# Altium schematic sheet Receiver.SchDoc
size A3; Organization: Altium Limited; Address1: L3, 12a Rodborough Rd; Address2: Frenchs Forest; Address3: NSW; Address4: Australia 2086
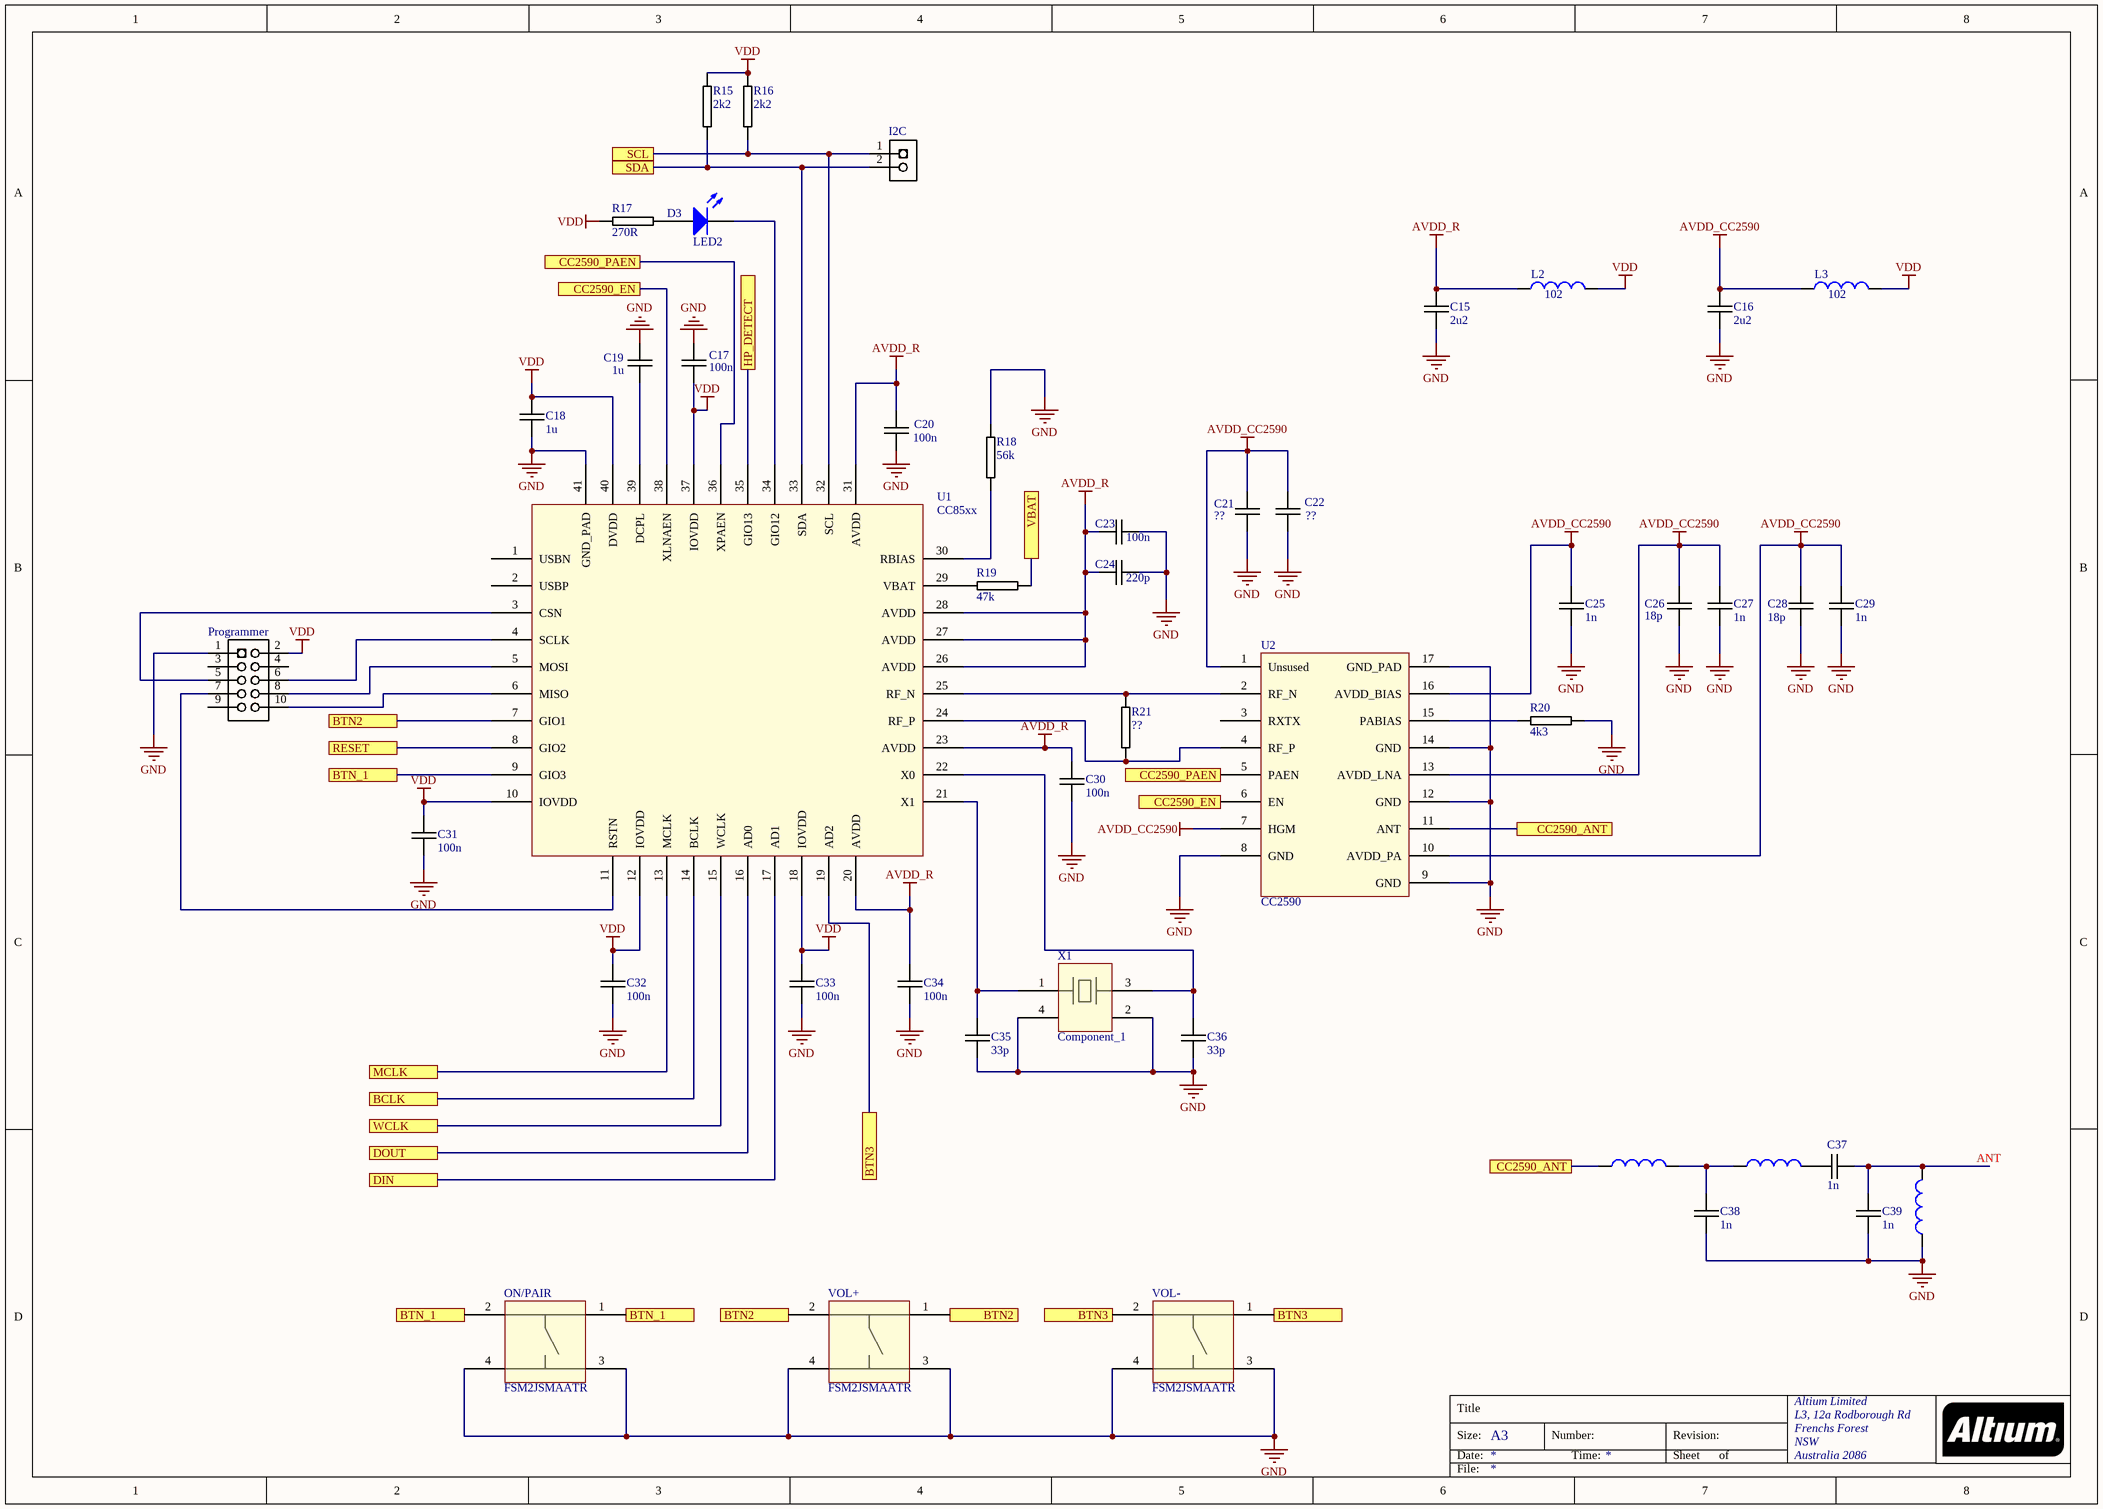
[diagram p0: Receiver.SchDoc]

## Parts
C15  2u2  [0402C-TBD]
C16  2u2  [0402C-TBD]
C17  100n  [0402C-TBD]
C18  1u  [0402C-TBD]
C19  1u  [0402C-TBD]
C20  100n  [0402C-TBD]
C21  ??  [0402C-TBD]
C22  ??  [0402C-TBD]
C23  100n  [0402C-TBD]
C24  220p  [0402C-TBD]
C25  1n  [0402C-TBD]
C26  18p  [0402C-TBD]
C27  1n  [0402C-TBD]
C28  18p  [0402C-TBD]
C29  1n  [0402C-TBD]
C30  100n  [0402C-TBD]
C31  100n  [0402C-TBD]
C32  100n  [0402C-TBD]
C33  100n  [0402C-TBD]
C34  100n  [0402C-TBD]
C35  33p  [0402C-TBD]
C36  33p  [0402C-TBD]
C37  1n  [0402C-TBD]
C38  1n  [0402C-TBD]
C39  1n  [0402C-TBD]
D3  LED2  [0402C-GENERIC]
I2C  I2C  [HEADER-1X2]  (value not drawn)
L2  value 102  [0402-A]  (hidden comment: Inductor)
L3  value 102  [0402-A]  (hidden comment: Inductor)
L11  Inductor  [0402-A]  (value not drawn)
L12  Inductor  [0402-A]  (value not drawn)
L13  Inductor  [0402-A]  (value not drawn)
ON/PAIR  FSM2JSMAATR  [Tactile Button]
Programmer  Programm  [HEADER-2X5]  (value not drawn)
R15  2k2  [0402R-GENERIC]
R16  2k2  [0402R-GENERIC]
R17  270R  [0402R-GENERIC]
R18  56k  [0402R-GENERIC]
R19  47k  [0402R-GENERIC]
R20  4k3  [0402R-GENERIC]
R21  ??  [0402R-GENERIC]
U1  CC85xx  [QFN40]
U2  CC2590  [QFN16]
VOL+  FSM2JSMAATR  [Tactile Button]
VOL-  FSM2JSMAATR  [Tactile Button]
X1  Component_1  [*XTALDFN200X160X70-4N]

## Ports
BCLK, BTN2, BTN3, BTN_1, CC2590_ANT, CC2590_EN, CC2590_PAEN, DIN, DOUT, HP_DETECT, MCLK, RESET, SCL, SDA, VBAT, WCLK

## Nets
AVDD_CC2590: C16.1 C21.1 C22.1 C25.1 C26.1 C27.1 C28.1 C29.1 L3.1 U2.1(Unsused) U2.7(HGM) U2.10(AVDD_PA) U2.13(AVDD_LNA) U2.16(AVDD_BIAS)
AVDD_R: C15.1 C20.1 C23.2 C24.2 C30.1 C34.1 L2.1 U1.20(AVDD) U1.23(AVDD) U1.26(AVDD) U1.27(AVDD) U1.28(AVDD) U1.31(AVDD)
GND: C15.2 C16.2 C17.1 C18.2 C19.1 C20.2 C21.2 C22.2 C23.1 C24.1 C25.2 C26.2 C27.2 C28.2 C29.2 C30.2 C31.2 C32.2 C33.2 C34.2 C35.2 C36.2 C38.2 C39.2 L13.1 ON/PAIR.3 ON/PAIR.4 Programmer.1 R18.1 R20.2 U1.41(GND_PAD) U2.8(GND) U2.9(GND) U2.12(GND) U2.14(GND) U2.17(GND_PAD) VOL+.3 VOL+.4 VOL-.3 VOL-.4 X1.2 X1.4
VDD: C17.2 C18.1 C31.1 C32.1 C33.1 L2.2 L3.2 Programmer.2 R15.1 R16.1 R17.1 U1.10(IOVDD) U1.12(IOVDD) U1.18(IOVDD) U1.37(IOVDD) U1.40(DVDD)
BCLK: U1.14(BCLK) ; port BCLK
BTN2: U1.7(GIO1) VOL+.1 VOL+.2 ; port BTN2
BTN3: U1.19(AD2) VOL-.1 VOL-.2 ; port BTN3
BTN_1: ON/PAIR.1 ON/PAIR.2 U1.9(GIO3) ; port BTN_1
CC2590_ANT: L11.1 U2.11(ANT) ; port CC2590_ANT
CC2590_EN: U1.38(XLNAEN) U2.6(EN) ; port CC2590_EN
CC2590_PAEN: U1.36(XPAEN) U2.5(PAEN) ; port CC2590_PAEN
DIN: U1.17(AD1) ; port DIN
DOUT: U1.16(AD0) ; port DOUT
HP_DETECT: U1.35(GIO13) ; port HP_DETECT
MCLK: U1.13(MCLK) ; port MCLK
RESET: U1.8(GIO2) ; port RESET
SCL: I2C.1 R16.2 U1.32(SCL) ; port SCL
SDA: I2C.2 R15.2 U1.33(SDA) ; port SDA
VBAT: R19.2 ; port VBAT
WCLK: U1.15(WCLK) ; port WCLK
NetC19_2: C19.2 U1.39(DCPL)
NetC35_1: C35.1 U1.21(X1) X1.1
NetC36_1: C36.1 U1.22(X0) X1.3
NetC37_1: C37.1 L12.2
NetC37_2: C37.2 C39.1 L13.2
NetC38_1: C38.1 L11.2 L12.1
NetD3_1: D3.1(A) R17.2
NetD3_2: D3.2(K) U1.34(GIO12)
NetProgrammer_5: Programmer.5 U1.3(CSN)
NetProgrammer_6: Programmer.6 U1.4(SCLK)
NetProgrammer_7: Programmer.7 U1.11(RSTN)
NetProgrammer_8: Programmer.8 U1.5(MOSI)
NetProgrammer_10: Programmer.10 U1.6(MISO)
NetR18_2: R18.2 U1.30(RBIAS)
NetR19_1: R19.1 U1.29(VBAT)
NetR20_1: R20.1 U2.15(PABIAS)
NetR21_1: R21.1 U1.24(RF_P) U2.4(RF_P)
NetR21_2: R21.2 U1.25(RF_N) U2.2(RF_N)

Not connected (* = marked no-connect by the designer): Programmer 3 4 9; U1 1(USBN) 2(USBP); U2 3(RXTX)

## Notes on the sheet
- ANT
- Title
- Size:
- Date:
- A3
- Number:
- Time:
- Revision:
- Sheet
- of
- File:

## Library data of the parts
C15-C39 = 0402C-TBD: CAPACITOR 0402 CERAMIC
D3 = LED2: Typical RED, GREEN, YELLOW, AMBER GaAs LED; Published: 8-Jun-2000; LatestRevisionDate: 17-Jul-2002; LatestRevisionNote: Re-released for DXP Platform.; PackageVersion: Feb-2002; PackageReference: 3.2X1.6X1.1; Publisher: Altium Limited; PackageDescription: SM LED; 2 Flat Leads
I2C = HEADER-1X2: REEL: TH; Supplier 1: Digi-Key; Supplier Part Number 1: S1011E-36-ND
L2 L3 = Inductor: Code_IEC: 1005; Published: 8-Jun-2000; LatestRevisionDate: 29-May-2009; LatestRevisionNote: IPC-7351 Footprint Added.; PackageReference: 0402-A; Publisher: Altium Limited; PackageDescription: Chip Inductor; Code_JEITA: 0402
L11-L13 = Inductor: Code_IEC: 1005; Value: 6n8; Published: 8-Jun-2000; LatestRevisionDate: 29-May-2009; LatestRevisionNote: IPC-7351 Footprint Added.; PackageReference: 0402-A; Publisher: Altium Limited; PackageDescription: Chip Inductor; Code_JEITA: 0402
ON/PAIR VOL+ VOL- = FSM2JSMAATR: Tactile Button
Programmer = HEADER-2X5
R15-R21 = 0402R-GENERIC: RESISTOR 0402 GENERIC
U1 = CC85xx: 2.4 GHz RF SoC FOR WIRELESS DIGITAL AUDIO STREAMING CC8520, CC8521, CC8530 & CC8531 - PurePath™ Wireless
U2 = CC2590: 2.4-GHzRFFrontEnd,14-dBmoutputpower